# Altium schematic sheet Blockschaltbild AirScoutV2.SchDoc
size A3
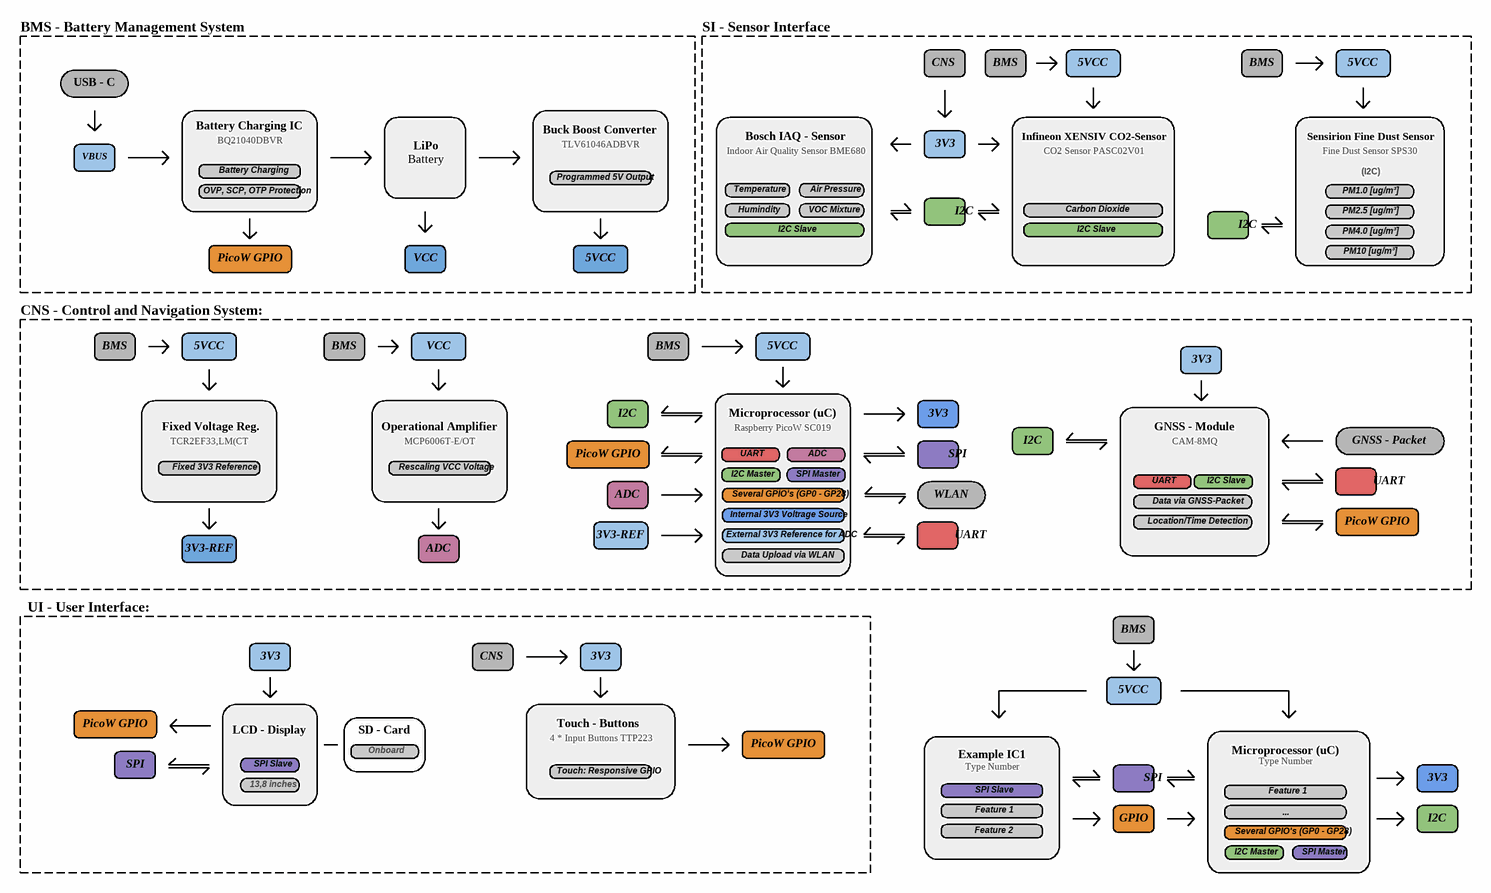
[diagram p0: Blockschaltbild AirScoutV2.SchDoc]

## Notes on the sheet
- BMS - Battery Management System
- SI - Sensor Interface
- CNS
- BMS
- 5VCC
- USB - C
- Battery Charging IC
- BQ21040DBVR
- Buck Boost Converter
- Bosch IAQ - Sensor
- Infineon XENSIV CO2-Sensor
- Sensirion Fine Dust Sensor
- VBUS
- OVP, SCP, OTP Protection
- Battery Charging
- Battery
- LiPo
- Programmed 5V Output
- TLV61046ADBVR
- Indoor Air Quality Sensor BME680
- Temperature
- Humindity
- VOC Mixture
- Air Pressure
- 3V3
- I2C
- CO2 Sensor PASC02V01
- Carbon Dioxide
- Fine Dust Sensor SPS30
- PM1.0 [ug/m³]
- PM2.5 [ug/m³]
- (I2C)
- PicoW GPIO
- VCC
- I2C Slave
- PM4.0 [ug/m³]
- PM10 [ug/m³]
- CNS - Control and Navigation System:
- Fixed Voltage Reg.
- TCR2EF33,LM(CT
- Fixed 3V3 Reference
- Operational Amplifier
- Rescaling VCC Voltage
- MCP6006T-E/OT
- Microprocessor (uC)
- I2C Master
- Raspberry PicoW SC019
- UART
- SPI Master
- ADC
- SPI
- GNSS - Module
- CAM-8MQ
- GNSS - Packet
- 3V3-REF
- External 3V3 Reference for ADC
- Internal 3V3 Voltrage Source
- Several GPIO's (GP0 - GP28)
- WLAN
- Location/Time Detection
- Data via GNSS-Packet
- UI - User Interface:
- Data Upload via WLAN
- LCD - Display
- SD - Card
- Onboard
- 4 * Input Buttons TTP223
- Touch - Buttons
- 13,8 inches
- SPI Slave
- Touch: Responsive GPIO
- Example IC1
- Type Number
- Feature 1
- ...
- Feature 2
- GPIO